# Altium schematic sheet Microcontroller.SchDoc
size A3; Revision: AA; SheetNumber: 3; SheetTotal: 3; PreparedBy: Furkan Çağatay Ekinci; ProjectDescription: Turkish Coffee Machine; ReleaseDate: 24.12.2023; changedDate: 28.12.2023
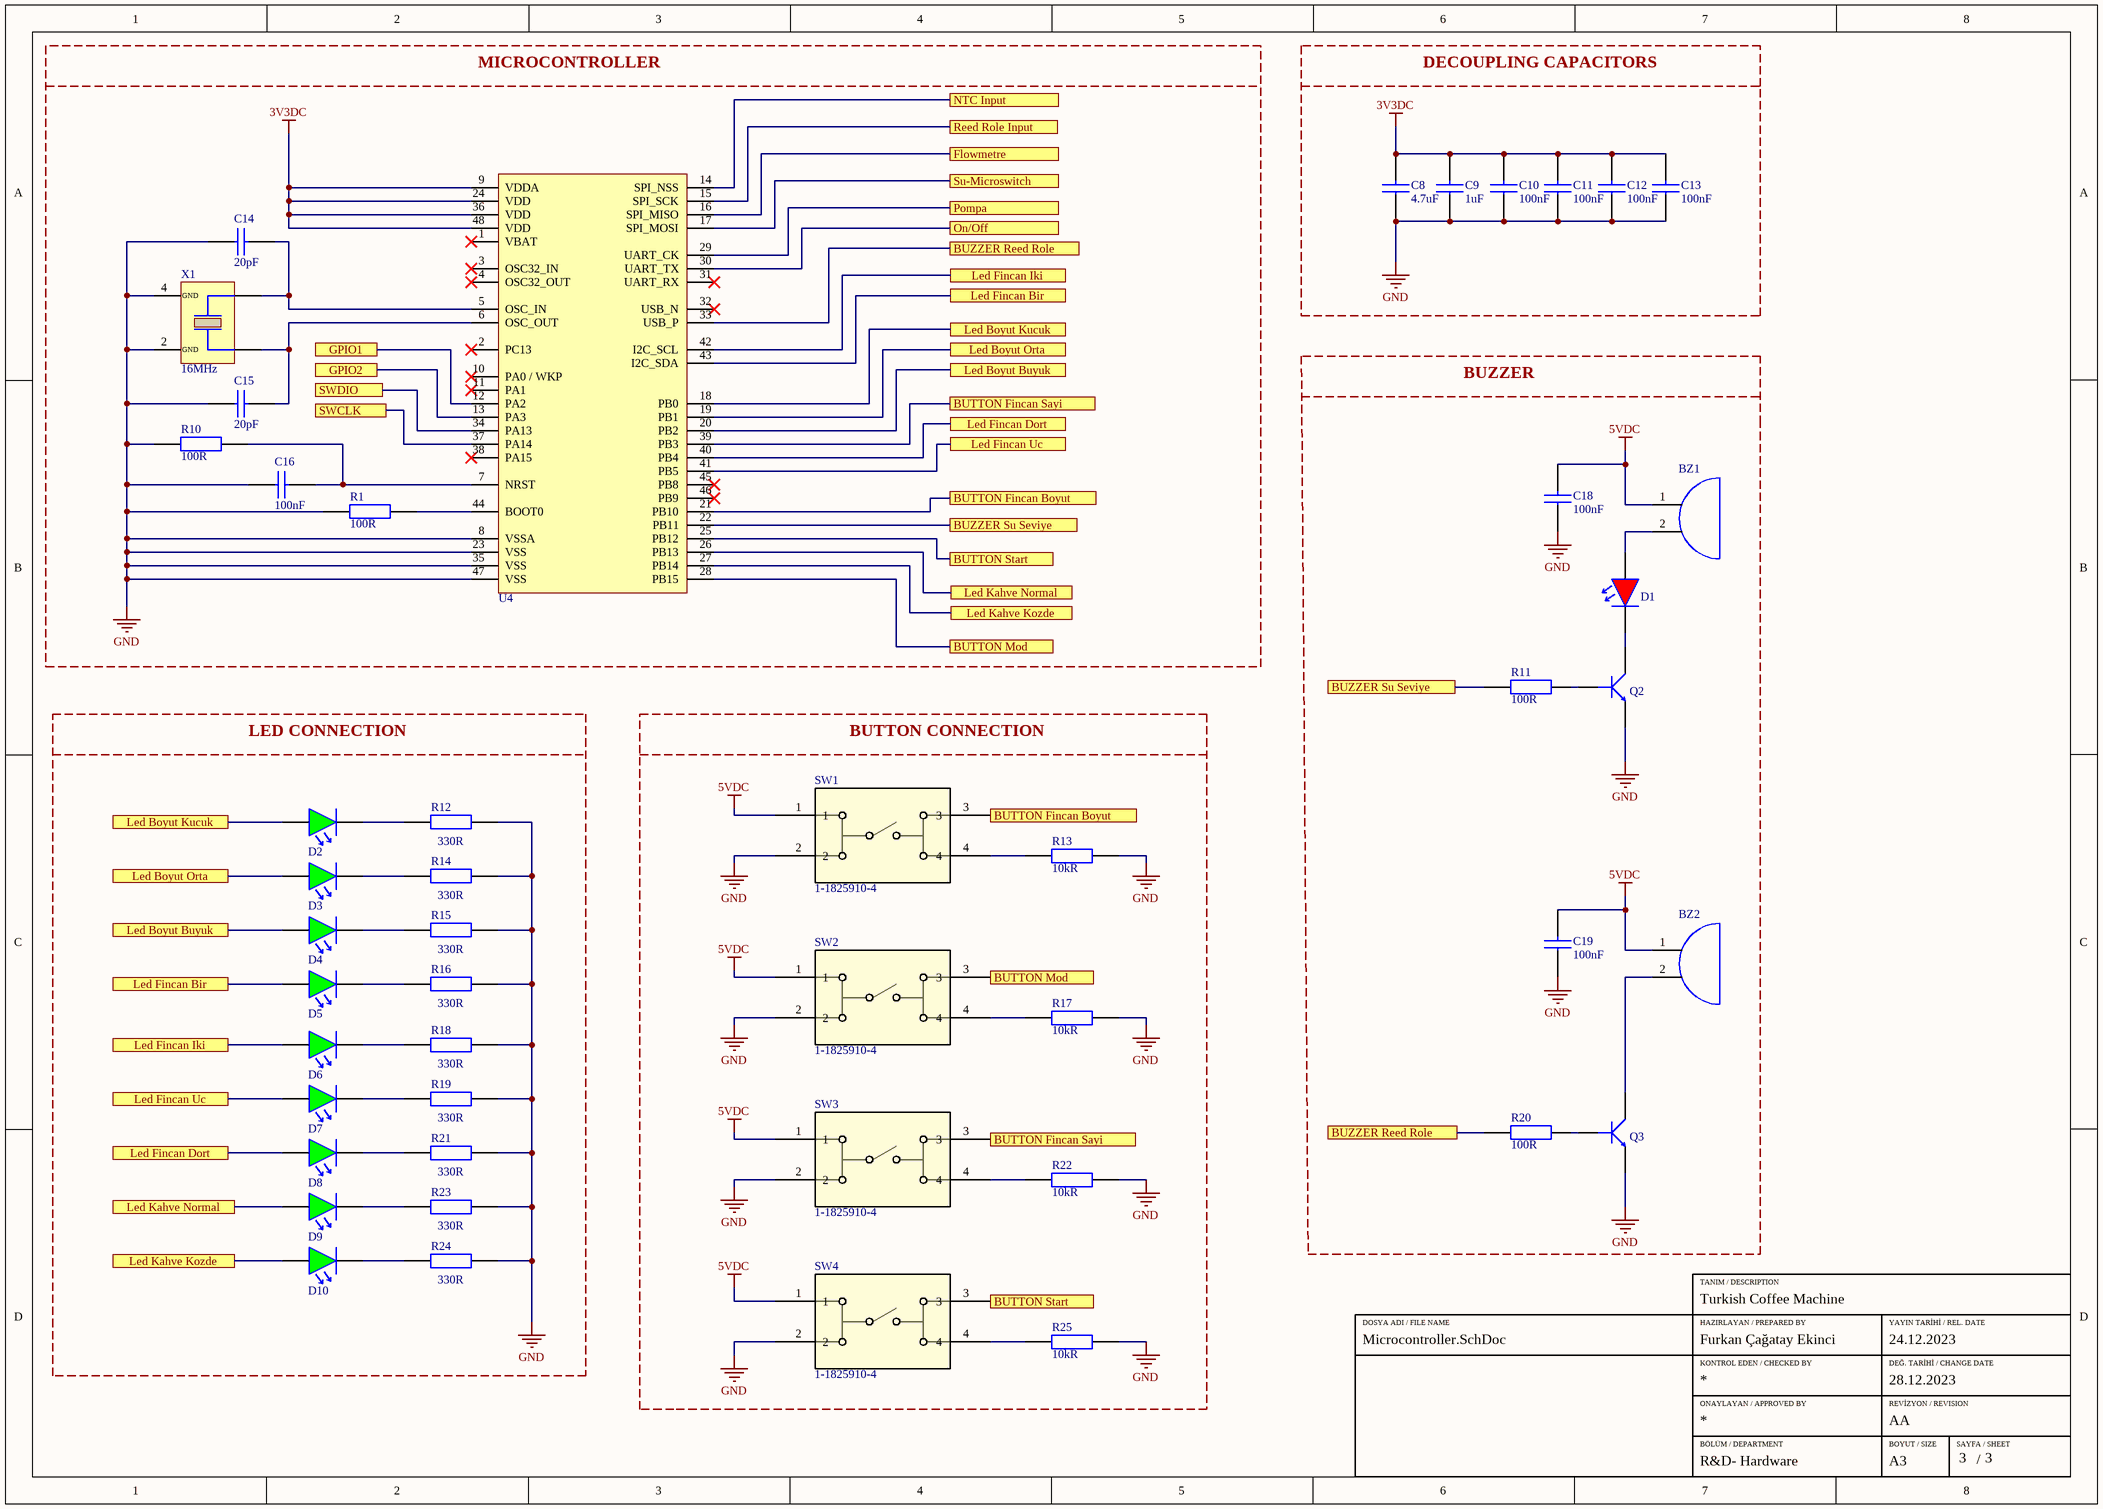
[diagram p0: Microcontroller.SchDoc]

## Parts
BZ1  CMI-9605IC-0580T  [CMI-9605IC]  (value not drawn)
BZ2  CMI-9605IC-0580T  [CMI-9605IC]  (value not drawn)
C8  Capacitance: 4.7uF  [CAP_0805]  (hidden comment: CL21A475KAQNNNE)
C9  Capacitance: 1uF  [CAP_0805]  (hidden comment: CL21B105KBFNNNE)
C10  Capacitance: 100nF  [CAP_0603]  (hidden comment: C0603C104K5RACTU)
C11  Capacitance: 100nF  [CAP_0603]  (hidden comment: C0603C104K5RACTU)
C12  Capacitance: 100nF  [CAP_0603]  (hidden comment: C0603C104K5RACTU)
C13  Capacitance: 100nF  [CAP_0603]  (hidden comment: C0603C104K5RACTU)
C14  Capacitance: 20pF  [CAP_0603]  (hidden comment: CL10C200JB8NNNC)
C15  Capacitance: 20pF  [CAP_0603]  (hidden comment: CL10C200JB8NNNC)
C16  Capacitance: 100nF  [CAP_0603]  (hidden comment: C0603C104K5RACTU)
C18  Capacitance: 100nF  [CAP_0603]  (hidden comment: C0603C104K5RACTU)
C19  Capacitance: 100nF  [CAP_0603]  (hidden comment: C0603C104K5RACTU)
D1  LH R974-LP-1  [LED_RED_0805]  (value not drawn)
D2  LTST-C171GKT  [LED_GREEN_0805]  (value not drawn)
D3  LTST-C171GKT  [LED_GREEN_0805]  (value not drawn)
D4  LTST-C171GKT  [LED_GREEN_0805]  (value not drawn)
D5  LTST-C171GKT  [LED_GREEN_0805]  (value not drawn)
D6  LTST-C171GKT  [LED_GREEN_0805]  (value not drawn)
D7  LTST-C171GKT  [LED_GREEN_0805]  (value not drawn)
D8  LTST-C171GKT  [LED_GREEN_0805]  (value not drawn)
D9  LTST-C171GKT  [LED_GREEN_0805]  (value not drawn)
D10  LTST-C171GKT  [LED_GREEN_0805]  (value not drawn)
Q2  MMBT3904-7-F  [SOT-23F]  (value not drawn)
Q3  MMBT3904-7-F  [SOT-23F]  (value not drawn)
R1  Resistance: 100R  [RES_0603]  (hidden comment: RC0603JR-07100RL)
R10  Resistance: 100R  [RES_0603]  (hidden comment: RC0603JR-07100RL)
R11  Resistance: 100R  [RES_0603]  (hidden comment: RC0603JR-07100RL)
R12  RC0603JR-07330RL  [RES_0603]  (value not drawn)
R13  Resistance: 10kR  [RES_0603]  (hidden comment: RC0603FR-0710KL)
R14  RC0603JR-07330RL  [RES_0603]  (value not drawn)
R15  RC0603JR-07330RL  [RES_0603]  (value not drawn)
R16  RC0603JR-07330RL  [RES_0603]  (value not drawn)
R17  Resistance: 10kR  [RES_0603]  (hidden comment: RC0603FR-0710KL)
R18  RC0603JR-07330RL  [RES_0603]  (value not drawn)
R19  RC0603JR-07330RL  [RES_0603]  (value not drawn)
R20  Resistance: 100R  [RES_0603]  (hidden comment: RC0603JR-07100RL)
R21  RC0603JR-07330RL  [RES_0603]  (value not drawn)
R22  Resistance: 10kR  [RES_0603]  (hidden comment: RC0603FR-0710KL)
R23  RC0603JR-07330RL  [RES_0603]  (value not drawn)
R24  RC0603JR-07330RL  [RES_0603]  (value not drawn)
R25  Resistance: 10kR  [RES_0603]  (hidden comment: RC0603FR-0710KL)
SW1  1-1825910-4  [SW4_1825910-D_TEC]
SW2  1-1825910-4  [SW4_1825910-D_TEC]
SW3  1-1825910-4  [SW4_1825910-D_TEC]
SW4  1-1825910-4  [SW4_1825910-D_TEC]
U4  STM32F103C6T6A  [LQFP-48]  (value not drawn)
X1  Frequency: 16MHz  [ECS]  (hidden comment: ECS-160-20-30B-TR)

## Blocks framed on the sheet
MICROCONTROLLER: C14-C16 R1 R10 U4 X1
DECOUPLING CAPACITORS: C8-C13
BUZZER: BZ1 BZ2 C18 C19 D1 Q2 Q3 R11 R20
LED CONNECTION: D2-D10 R12 R14-R16 R18 R19 R21 R23 R24
BUTTON CONNECTION: R13 R17 R22 R25 SW1-SW4

## Ports
BUTTON Fincan Boyut (see Microcontroller[4B]), BUTTON Fincan Boyut (see Microcontroller[4C]), BUTTON Fincan Sayi (see Microcontroller[4B]), BUTTON Fincan Sayi (see Microcontroller[4D]), BUTTON Mod (see Microcontroller[4B]), BUTTON Mod (see Microcontroller[4C]), BUTTON Start (see Microcontroller[4B]), BUTTON Start (see Microcontroller[4D]), BUZZER Reed Role (see Microcontroller[4A]), BUZZER Reed Role (see Microcontroller[6D]), BUZZER Su Seviye (see Microcontroller[4B]), BUZZER Su Seviye (see Microcontroller[6B]), Flowmetre (see Power Management[7C]), GPIO1 (see Power Management[7C]), GPIO2 (see Power Management[7C]), Led Boyut Buyuk (see Microcontroller[1C]), Led Boyut Buyuk (see Microcontroller[4A]), Led Boyut Kucuk (see Microcontroller[1C]), Led Boyut Kucuk (see Microcontroller[4A]), Led Boyut Orta (see Microcontroller[1C]), Led Boyut Orta (see Microcontroller[4A]), Led Fincan Bir (see Microcontroller[1C]), Led Fincan Bir (see Microcontroller[4A]), Led Fincan Dort (see Microcontroller[1D]), Led Fincan Dort (see Microcontroller[4B]), Led Fincan Iki (see Microcontroller[1C]), Led Fincan Iki (see Microcontroller[4A]), Led Fincan Uc (see Microcontroller[1C]), Led Fincan Uc (see Microcontroller[4B]), Led Kahve Kozde (see Microcontroller[1D]), Led Kahve Kozde (see Microcontroller[4B]), Led Kahve Normal (see Microcontroller[1D]), Led Kahve Normal (see Microcontroller[4B]), NTC Input (see Power Management[6C]), On/Off (see Power Management[5A]), Pompa (see Power Management[7C]), Reed Role Input (see Power Management[6C]), Su-Microswitch (see Power Management[7C]), SWCLK (see Power Management[5C]), SWDIO (see Power Management[5C])

## Nets
3V3DC: C8.2 C9.2 C10.2 C11.2 C12.2 C13.2 U4.9(VDDA) U4.24(VDD) U4.36(VDD) U4.48(VDD)
5VDC: BZ1.1 BZ2.1 C18.2 C19.2 SW1.1 SW2.1 SW3.1 SW4.1
GND: C8.1 C9.1 C10.1 C11.1 C12.1 C13.1 C14.1 C15.1 C16.1 C18.1 C19.1 Q2.2(E) Q3.2(E) R1.1 R10.1 R12.2 R13.2 R14.2 R15.2 R16.2 R17.2 R18.2 R19.2 R21.2 R22.2 R23.2 R24.2 R25.2 SW1.2 SW2.2 SW3.2 SW4.2 U4.8(VSSA) U4.23(VSS) U4.35(VSS) U4.47(VSS) X1.2(GND) X1.4(GND)
BUTTON Fincan Boyut: SW1.3 U4.21(PB10) ; port BUTTON Fincan Boyut
BUTTON Fincan Sayi: SW3.3 U4.39(PB3) ; port BUTTON Fincan Sayi
BUTTON Mod: SW2.3 U4.28(PB15) ; port BUTTON Mod
BUTTON Start: SW4.3 U4.25(PB12) ; port BUTTON Start
BUZZER Reed Role: R20.1 U4.33(USB_P) ; port BUZZER Reed Role
BUZZER Su Seviye: R11.1 U4.22(PB11) ; port BUZZER Su Seviye
Flowmetre: U4.16(SPI_MISO) ; port Flowmetre
GPIO1: U4.12(PA2) ; port GPIO1
GPIO2: U4.13(PA3) ; port GPIO2
Led Boyut Buyuk: D4.2 U4.20(PB2) ; port Led Boyut Buyuk
Led Boyut Kucuk: D2.2 U4.18(PB0) ; port Led Boyut Kucuk
Led Boyut Orta: D3.2 U4.19(PB1) ; port Led Boyut Orta
Led Fincan Bir: D5.2 U4.43(I2C_SDA) ; port Led Fincan Bir
Led Fincan Dort: D8.2 U4.40(PB4) ; port Led Fincan Dort
Led Fincan Iki: D6.2 U4.42(I2C_SCL) ; port Led Fincan Iki
Led Fincan Uc: D7.2 U4.41(PB5) ; port Led Fincan Uc
Led Kahve Kozde: D10.2 U4.27(PB14) ; port Led Kahve Kozde
Led Kahve Normal: D9.2 U4.26(PB13) ; port Led Kahve Normal
NTC Input: U4.14(SPI_NSS) ; port NTC Input
On/Off: U4.30(UART_TX) ; port On/Off
Pompa: U4.29(UART_CK) ; port Pompa
Reed Role Input: U4.15(SPI_SCK) ; port Reed Role Input
Su-Microswitch: U4.17(SPI_MOSI) ; port Su-Microswitch
SWCLK: U4.37(PA14) ; port SWCLK
SWDIO: U4.34(PA13) ; port SWDIO
NetBZ1_2: BZ1.2 D1.2
NetBZ2_2: BZ2.2 Q3.3(C)
NetC14_2: C14.2 U4.5(OSC_IN) X1.3
NetC15_2: C15.2 U4.6(OSC_OUT) X1.1
NetC16_2: C16.2 R10.2 U4.7(NRST)
NetD1_1: D1.1 Q2.3(C)
NetD2_1: D2.1 R12.1
NetD3_1: D3.1 R14.1
NetD4_1: D4.1 R15.1
NetD5_1: D5.1 R16.1
NetD6_1: D6.1 R18.1
NetD7_1: D7.1 R19.1
NetD8_1: D8.1 R21.1
NetD9_1: D9.1 R23.1
NetD10_1: D10.1 R24.1
NetQ2_1: Q2.1(B) R11.2
NetQ3_1: Q3.1(B) R20.2
NetR1_2: R1.2 U4.44(BOOT0)
NetR13_1: R13.1 SW1.4
NetR17_1: R17.1 SW2.4
NetR22_1: R22.1 SW3.4
NetR25_1: R25.1 SW4.4

Not connected (* = marked no-connect by the designer): U4 1(VBAT)* 2(PC13)* 3(OSC32_IN)* 4(OSC32_OUT)* 10(PA0_/_WKP)* 11(PA1)* 31(UART_RX)* 32(USB_N)* 38(PA15)* 45(PB8)* 46(PB9)*

## Notes on the sheet
- DOSYA ADI / FILE NAME
- HAZIRLAYAN / PREPARED BY
- TANIM / DESCRIPTION
- YAYIN TARİHİ / REL. DATE
- KONTROL EDEN / CHECKED BY
- DEĞ. TARİHİ / CHANGE DATE
- ONAYLAYAN / APPROVED BY
- BÖLÜM / DEPARTMENT
- BOYUT / SIZE
- REVİZYON / REVISION
- SAYFA / SHEET
- /
- R&D- Hardware
- A3

## Library data of the parts
BZ1 BZ2 = CMI-9605IC-0580T: Audio Buzzer Magnetic 3VDC 7VDC 30mA 5VDC 85dB 2600Hz to 2800Hz Through Hole Pin Box; Manufacturer: CUI Devices; Designed By: FCE; Supplier: Digi-Key; Supplier Part Number: 2223-CMI-9605IC-0580T-ND; Manufacturer Part Number: CMI-9605IC-0580T; RoHS: No; Category: Audio Products; Stock: 5921; Pricing: 1=1,22000, 10=1,01400, 25=0,93800, 50=0,88300, 100=0,82980, 250=0,76976, 500=0,71396, 1000=0,66741, 5000=0,65403 (USD)
C8 = CAP CER 4.7uF 0805: CAP CER 4.7uF %10 0805; Manufacturer: Samsung; Tolerance: 10%; Voltage Rating: 25V; Dielectric: X5R; Designed by: FCE; Supplier 1: Digi-Key; Manufacturer Part Number: CL21A475KAQNNNE; RoHS: Yes; Category: Ceramic Capacitors; Stock 1: 1477018; Pricing 1: 1=0,11000, 10=0,08100, 50=0,04580, 100=0,03800, 500=0,02664, 1000=0,02205 (USD); Mount: Surface Mount; Case/Package: 0805; Case Code (Metric): 2012; Case Code (Imperial): 0805; Min Operating Temperature: -55°C; Max Operating Temperature: 85°C; Package Quantity: 1; Packaging: Tape and Reel; Voltage Rating (DC): 25V; Series: CL; Construction: Flat; Length: 2mm; Width: 0.049inch; Height: 1.25mm; Thickness: 0.055inch; Depth: 1.25mm; Radiation Hardening: No; Lead Free: Lead Free; RoHS Compliant: Yes; ComponentLink1URL: https://datasheet.ciiva.com/25798/cl21a475kaqnnne-25798882.pdf?src-supplier=Digi-Key; ComponentLink1Description: https://datasheet.ciiva.com/25798/cl21a475kaqnnne-25798882.pdf?src-supplier=Digi-Key; Supplier Part Number 1: 1276-1244-1-ND
C9 = CAP CER 1uF 0805: CAP CER 1uF %10 0805; Manufacturer: Samsung; Designed by: FCE; Tolerance: 10%; Voltage Rating: 50V; Dielectric: X7R; Supplier 1: Digi-Key; Manufacturer Part Number: CL21B105KBFNNNE; RoHS: Yes; Category: Ceramic Capacitors; Stock 1: 958000; Pricing 1: 2000=0,02138, 4000=0,01956 (USD); Mount: Surface Mount; Case/Package: 0805; Case Code (Metric): 2012; Case Code (Imperial): 0805; Min Operating Temperature: -55°C; Max Operating Temperature: 125°C; Packaging: Tape and Reel; Package Quantity: 1; Voltage: 50V; Series: CL; Construction: Flat; Length: 2mm; Width: 0.049inch; Height: 1.25mm; Thickness: 0.053inch; Depth: 1.25mm; Radiation Hardening: No; RoHS Compliant: Yes; ComponentLink1URL: https://datasheet.ciiva.com/25800/cl21b105kbfnnne-25800291.pdf?src-supplier=Digi-Key; ComponentLink1Description: https://datasheet.ciiva.com/25800/cl21b105kbfnnne-25800291.pdf?src-supplier=Digi-Key; ComponentLink2URL: https://datasheet.ciiva.com/16449/cl21b105kbfnnne-16449003.pdf?src-supplier=Future+Electronics; ComponentLink2Description: https://datasheet.ciiva.com/16449/cl21b105kbfnnne-16449003.pdf?src-supplier=Future+Electronics; ComponentLink3URL: https://datasheet.ciiva.com/26838/getdatasheetpartid-354075-26838668.pdf?src-supplier=Verical; ComponentLink3Description: https://datasheet.ciiva.com/26838/getdatasheetpartid-354075-26838668.pdf?src-supplier=Verical; Supplier Part Number 1: 1276-1029-2-ND
C10-C13 C16 C18 C19 = CAP CER 100nF 0603: CAP CER 100nF %10 0603 SMD; Manufacturer: KEMET; Designed by: FCE; Dielectric Material: Ceramic; Voltage Rating (DC): 50V; Tolerance: 10%; Dielectric: X7R; Dissipation Factor: 2.5%; Supplier 1: Digi-Key; Manufacturer Part Number: C0603C104K5RACTU; RoHS: Yes; Category: Ceramic Capacitors; Stock 1: 1666186; Pricing 1: 1=0,12000, 10=0,08500, 50=0,04620, 100=0,03770, 500=0,02696, 1000=0,02118 (USD); Mount: Surface Mount; Case/Package: 0603; Number of Pins: 2; Case Code (Metric): 1608; Case Code (Imperial): 0603; Contact Plating: Tin,Matte; Min Operating Temperature: -55°C; Max Operating Temperature: 125°C; Packaging: Tape and Reel; Package Quantity: 1; Termination: SMD/SMT; Voltage: 50V; Voltage Rating: 50V; Series: SMD Comm X7R; Length: 0.063inch; Width: 0.031inch; Height: 0.8mm; Thickness: 0.034inch; Lead Pitch: 0.7mm; Depth: 0.8mm; Radiation Hardening: No; RoHS Compliant: Yes; REACH SVHC: No SVHC; ComponentLink1URL: https://datasheet.ciiva.com/7823/kem-c1002-x7r-smd-7823591.pdf?src-supplier=Element14; ComponentLink1Description: https://datasheet.ciiva.com/7823/kem-c1002-x7r-smd-7823591.pdf?src-supplier=Element14; ComponentLink2URL: https://datasheet.ciiva.com/14602/70095383-14602583.pdf?src-supplier=Allied+Electronics; ComponentLink2Description: https://datasheet.ciiva.com/14602/70095383-14602583.pdf?src-supplier=Allied+Electronics; ComponentLink3URL: https://datasheet.ciiva.com/5999/kem-c1002-x7r-smd-5999400.pdf?src-supplier=Farnell; ComponentLink3Description: https://datasheet.ciiva.com/5999/kem-c1002-x7r-smd-5999400.pdf?src-supplier=Farnell; ComponentLink4URL: https://datasheet.ciiva.com/7823/kem-c1002-x7r-smd-7823592.pdf?src-supplier=Element14; ComponentLink4Description: https://datasheet.ciiva.com/7823/kem-c1002-x7r-smd-7823592.pdf?src-supplier=Element14; ComponentLink5URL: https://datasheet.ciiva.com/28645/1851736-28645640.pdf?src-supplier=Element14; ComponentLink5Description: https://datasheet.ciiva.com/28645/1851736-28645640.pdf?src-supplier=Element14; ComponentLink6URL: https://datasheet.ciiva.com/14585/70095383-14585209.pdf?src-supplier=Allied+Electronics; ComponentLink6Description: https://datasheet.ciiva.com/14585/70095383-14585209.pdf?src-supplier=Allied+Electronics; Supplier Part Number 1: 399-5089-1-ND
C14 C15 = CAP CER 20pF 0603: CAP CER 20pF %5 0603 SMD; Manufacturer: Samsung; Tolerance: 5%; Dielectric: C0G; Voltage Rating: 50V; Temperature Coefficient: 300ppm/°C; Designed by: FCE; Supplier 1: Digi-Key; Manufacturer Part Number: CL10C200JB8NNNC; RoHS: Yes; Category: Ceramic Capacitors; Stock 1: 765558; Pricing 1: 1=0,10000, 10=0,04700, 50=0,02560, 100=0,02090, 500=0,01490, 1000=0,01171 (USD); Mount: Surface Mount; Case/Package: 0603; Case Code (Metric): 1608; Case Code (Imperial): 0603; Min Operating Temperature: -55°C; Max Operating Temperature: 125°C; Package Quantity: 1; Packaging: Tape and Reel; Voltage: 50V; Series: CL; Construction: Flat; Length: 1.6mm; Width: 0.031inch; Height: 0.8mm; Thickness: 0.035inch; Depth: 0.8mm; Radiation Hardening: No; RoHS Compliant: Yes; ComponentLink1URL: https://datasheet.ciiva.com/26877/getdatasheetpartid-640634-26877974.pdf?src-supplier=Verical; ComponentLink1Description: https://datasheet.ciiva.com/26877/getdatasheetpartid-640634-26877974.pdf?src-supplier=Verical; ComponentLink2URL: https://datasheet.ciiva.com/26310/mlcc-catalogdownload2013-eng-26310315.pdf?src-supplier=Distrelec; ComponentLink2Description: https://datasheet.ciiva.com/26310/mlcc-catalogdownload2013-eng-26310315.pdf?src-supplier=Distrelec; Supplier Part Number 1: 1276-1187-1-ND
D1 = LED RED 0805: LED Uni-Color Hyper Red 660nm 2-Pin Chip 0805(2012Metric) T/R; Manufacturer: Osram Opto; Lens Color: White; Forward Voltage: 1.8V; Lens Style: Diffused,Flat,Colorless; Luminous Intensity: 71mcd; Viewing Angle: 160°; Forward Current: 30mA; Dominant Wavelength: 645nm; Number of Elements: 1; Test Current: 20mA; Reverse Voltage: 5V; Lens Transparency: Diffused; Luminous Flux: 0.17lm; Lens Size: 1.25mm; Designed by: FCE; Supplier 1: Digi-Key; Manufacturer Part Number: LH R974-LP-1; RoHS: Yes; Category: LEDs; Stock 1: 35632; Pricing 1: 1=0,26000, 10=0,13900, 100=0,06480, 500=0,05978, 1000=0,04683, 2000=0,04584 (USD); Mount: Surface Mount; Case/Package: 0805; Number of Pins: 2; Color: Red; Case Code (Imperial): 0805; Case Code (Metric): 2012; Min Operating Temperature: -30°C; Max Operating Temperature: 85°C; Packaging: Tape and Reel; Illumination Color: Red; Package Quantity: 1; Series: CHipLED; Length: 2.1mm; Width: 1.25mm; Depth: 1.35mm; Radiation Hardening: No; RoHS Compliant: Yes; ComponentLink1URL: http://www.jameco.com/Jameco/Products/ProdDS/2085634.pdf?src-supplier=Jameco; ComponentLink1Description: http://www.jameco.com/Jameco/Products/ProdDS/2085634.pdf?src-supplier=Jameco; ComponentLink2URL: http://components.arrow.com/part/dataview/0323_01825492?src-supplier=Arrow+Europe; ComponentLink2Description: http://components.arrow.com/part/dataview/0323_01825492?src-supplier=Arrow+Europe; ComponentLink3URL: https://dammedia.osram.info/media/resource/hires/osram-dam-2493888/LH%20R974.pdf?src-supplier=Digi-Key; ComponentLink3Description: https://dammedia.osram.info/media/resource/hires/osram-dam-2493888/LH%20R974.pdf?src-supplier=Digi-Key; ComponentLink4URL: http://www.mouser.com/ds/2/311/LH%20R974%20-%20CHIPLED%200805-318659.pdf?src-supplier=Mouser; ComponentLink4Description: http://www.mouser.com/ds/2/311/LH%20R974%20-%20CHIPLED%200805-318659.pdf?src-supplier=Mouser; ComponentLink5URL: https://www.verical.com/server-webapp/html/getDatasheet?partID=258950&src-supplier=Verical; ComponentLink5Description: https://www.verical.com/server-webapp/html/getDatasheet?partID=258950&src-supplier=Verical; ComponentLink6URL: http://components.arrow.com/part/dataview/41971690S1077610N9133?src-supplier=Arrow+Electronics; ComponentLink6Description: http://components.arrow.com/part/dataview/41971690S1077610N9133?src-supplier=Arrow+Electronics; ComponentLink7URL: http://components.arrow.com/part/dataview/41971690S6190115N2128?src-supplier=Arrow+Electronics; ComponentLink7Description: http://components.arrow.com/part/dataview/41971690S6190115N2128?src-supplier=Arrow+Electronics; Supplier Part Number 1: 475-1415-1-ND
D2-D10 = LED GREEN 0805: Green 0805 130 º Min 5 mcd Typical 12 mcd Water Clear Lens SMT LED; Manufacturer: Vishay Lite-On; Designed by: FCE; Lens Color: Colorless; Viewing Angle: 130°; Lens Style: Diffused,Colorless,Rectangular,Clear; Luminous Intensity: 12mcd; Forward Current: 30mA; Forward Voltage: 2.1V; Power Rating: 100mW; Dominant Wavelength: 569nm; Test Current: 10mA; Number of Elements: 1; Wavelength: 585nm; Reverse Voltage: 5V; Supplier 1: Digi-Key; Manufacturer Part Number: LTST-C171GKT; RoHS: Yes; Category: LEDs; Stock 1: 159023; Pricing 1: 1=0,26000, 10=0,14100, 100=0,06560, 500=0,06060, 1000=0,04747 (USD); Mount: Surface Mount; Case/Package: 0805; Number of Pins: 2; Color: Green; Case Code (Metric): 2012; Case Code (Imperial): 0805; Min Operating Temperature: -55°C; Max Operating Temperature: 85°C; Package Quantity: 1; Packaging: Tape and Reel; Illumination Color: Green; Lens Transparency: Clear; Power Dissipation: 100mW; Number of LEDs: 1; Series: CHIPLED 0805; Length: 2mm; Width: 1.25mm; Height: 0.8mm; Depth: 1.25mm; Radiation Hardening: No; Lead Free: Lead Free; RoHS Compliant: Yes; ComponentLink1URL: https://datasheet.ciiva.com/2110/ltst-c171gkt-2110000.pdf?src-supplier=Digi-Key; ComponentLink1Description: https://datasheet.ciiva.com/2110/ltst-c171gkt-2110000.pdf?src-supplier=Digi-Key; ComponentLink2URL: https://datasheet.ciiva.com/11773/0900766b80dc0296-11773991.pdf?src-supplier=RSComponents; ComponentLink2Description: https://datasheet.ciiva.com/11773/0900766b80dc0296-11773991.pdf?src-supplier=RSComponents; ComponentLink3URL: https://datasheet.ciiva.com/12400/lite-on-ltst-c171gkt-190133-12400647.pdf?src-supplier=Mouser; ComponentLink3Description: https://datasheet.ciiva.com/12400/lite-on-ltst-c171gkt-190133-12400647.pdf?src-supplier=Mouser; ComponentLink4URL: https://datasheet.ciiva.com/2110/ltst-c171gkt-2110001.pdf?src-supplier=Digi-Key; ComponentLink4Description: https://datasheet.ciiva.com/2110/ltst-c171gkt-2110001.pdf?src-supplier=Digi-Key; ComponentLink5URL: https://datasheet.ciiva.com/2110/ltst-c171gkt-2110002.pdf?src-supplier=Digi-Key; ComponentLink5Description: https://datasheet.ciiva.com/2110/ltst-c171gkt-2110002.pdf?src-supplier=Digi-Key; ComponentLink6URL: https://datasheet.ciiva.com/16396/ltst-c171gkt-16396549.pdf?src-supplier=Future+Electronics; ComponentLink6Description: https://datasheet.ciiva.com/16396/ltst-c171gkt-16396549.pdf?src-supplier=Future+Electronics; Supplier Part Number 1: 160-1423-1-ND
Q2 Q3 = MMBT3904-7-F: Transistor General Purpose BJT NPN 40 Volt 0.2A Automotive 3-Pin SOT-23; Manufacturer: Diodes Zetex; Designed by: FCE; Max Power Dissipation: 300mW; Collector Emitter Voltage (VCEO): 40V; Max Collector Current: 200mA; Collector Base Voltage (VCBO): 60V; Frequency: 300MHz; hFE Min: 100; Number of Elements: 1; Emitter Base Voltage (VEBO): 6V; Collector Emitter Saturation Voltage: 300mV; Power Dissipation: 350mW; Element Configuration: Single; Supplier 1: Digi-Key; Manufacturer Part Number: MMBT3904-7-F; RoHS: Yes; Category: BJTs; Stock 1: 2393281; Pricing 1: 1=0,12000, 10=0,08600, 25=0,08280, 100=0,04660, 500=0,03664, 1000=0,02544 (USD); Mount: Surface Mount; Case/Package: SOT-23; Number of Pins: 3; Weight: 0.000282oz; Contact Plating: Tin,Matte; Min Operating Temperature: -55°C; Max Operating Temperature: 150°C; Polarity: NPN; Packaging: Tape and Reel; Package Quantity: 3000; Transition Frequency: 300MHz; Collector Emitter Breakdown Voltage: 40V; Max Breakdown Voltage: 40V; Continuous Collector Current: 200mA; Max Frequency: 300MHz; Gain Bandwidth Product: 300MHz; Series: -; Collector-emitter Voltage-Max: 300mV; Voltage Rating (DC): 40V; Length: 3.05mm; Width: 1.4mm; Height: 1mm; Radiation Hardening: No; REACH SVHC: No SVHC; Lead Free: Lead Free; RoHS Compliant: Yes; ComponentLink1URL: https://datasheet.ciiva.com/11201/ds30036-11201778.pdf?src-supplier=Avnet; ComponentLink1Description: https://datasheet.ciiva.com/11201/ds30036-11201778.pdf?src-supplier=Avnet; ComponentLink2URL: https://datasheet.ciiva.com/15138/getdatasheetpartid-53265-15138780.pdf?src-supplier=Verical; ComponentLink2Description: https://datasheet.ciiva.com/15138/getdatasheetpartid-53265-15138780.pdf?src-supplier=Verical; ComponentLink3URL: https://datasheet.ciiva.com/6361/ds30036-6361254.pdf?src-supplier=Digi-Key; ComponentLink3Description: https://datasheet.ciiva.com/6361/ds30036-6361254.pdf?src-supplier=Digi-Key; ComponentLink4URL: https://datasheet.ciiva.com/22711/1915516-22711750.pdf?src-supplier=Element14; ComponentLink4Description: https://datasheet.ciiva.com/22711/1915516-22711750.pdf?src-supplier=Element14; ComponentLink5URL: https://datasheet.ciiva.com/11198/ds30036-11198999.pdf?src-supplier=Avnet; ComponentLink5Description: https://datasheet.ciiva.com/11198/ds30036-11198999.pdf?src-supplier=Avnet; ComponentLink6URL: https://datasheet.ciiva.com/6361/ds30036-6361256.pdf?src-supplier=Digi-Key; ComponentLink6Description: https://datasheet.ciiva.com/6361/ds30036-6361256.pdf?src-supplier=Digi-Key; Supplier Part Number 1: MMBT3904-FDIDKR-ND
R1 R10 R11 R20 = RES 100 OHM 0603: RES 100 %5 OHM 0603 SMD; Manufacturer: Yageo; Designed by: FCE; Tolerance: 5%; Temperature Coefficient: 100ppm/°C; Voltage Rating (DC): 50V; Power Rating: 100mW; Supplier 1: Digi-Key; Manufacturer Part Number: RC0603JR-07100RL; RoHS: Yes; Category: Chip SMD Resistors; Stock 1: 4334796; Pricing 1: 1=0,10000, 10=0,01900, 100=0,00770, 1000=0,00344, 2500=0,00298 (USD); Case/Package: 0603; Number of Pins: 2; Contact Plating: Tin,Matte; Case Code (Imperial): 0603; Case Code (Metric): 1608; Size Code: 0603; Min Operating Temperature: -55°C; Max Operating Temperature: 155°C; Resistor Type: Thick Film; Packaging: Tape and Reel; Voltage Rating: 50V; Termination: SMD/SMT; Features: Moisture Resistant; Series: RC; Max Power Dissipation: 100mW; Number of Terminations: 2; Construction: Rectangular; Resistance Tolerance: 5%; Length: 1.6mm; Width: 0.8mm; Depth: 0.8mm; Radiation Hardening: No; REACH SVHC: Unknown; Lead Free: Lead Free; Military Standard: Not; RoHS Compliant: Yes; ComponentLink1URL: https://datasheet.ciiva.com/15189/getdatasheetpartid-325207-15189846.pdf?src-supplier=Verical; ComponentLink1Description: https://datasheet.ciiva.com/15189/getdatasheetpartid-325207-15189846.pdf?src-supplier=Verical; ComponentLink2URL: https://datasheet.ciiva.com/8883/pyu-rc0603-51-rohs-l-4-8883047.pdf?src-supplier=Avnet; ComponentLink2Description: https://datasheet.ciiva.com/8883/pyu-rc0603-51-rohs-l-4-8883047.pdf?src-supplier=Avnet; ComponentLink3URL: https://datasheet.ciiva.com/7746/443971-7746425.pdf?src-supplier=Element14; ComponentLink3Description: https://datasheet.ciiva.com/7746/443971-7746425.pdf?src-supplier=Element14; ComponentLink4URL: https://datasheet.ciiva.com/7746/443971-7746426.pdf?src-supplier=Element14; ComponentLink4Description: https://datasheet.ciiva.com/7746/443971-7746426.pdf?src-supplier=Element14; Supplier Part Number 1: 311-100GRCT-ND
R12 R14-R16 R18 R19 R21 R23 R24 = RES 330 OHM 0603: SMD Chip Resistor, 330 Ohm, ± 5%, 100 mW, 0603 [1608 Metric], Thick Film, General Purpose; Manufacturer: Yageo; Value: 330R; Power Rating: 100mW; Voltage Rating: 50V; Temperature Coefficient: 100ppm/°C; Designed By: FCE; Supplier: Digi-Key; Supplier Part Number: 311-330GRCT-ND; Manufacturer Part Number: RC0603JR-07330RL; RoHS: Yes; Category: Chip SMD Resistors; Stock: 3473788; Pricing: 1=0,10000, 10=0,01500, 50=0,00940, 100=0,00770, 500=0,00516, 1000=0,00441 (USD); Case/Package: 0603; Pins: 2; Case Code (Imperial): 0603; Case Code (Metric): 1608; Min Operating Temperature: -55°C; Max Operating Temperature: 155°C; Tolerance: 5%; Voltage Rating (DC): 50V; Resistor Type: Thick Film; Resistance Tolerance: 5%; Packaging: Tape and Reel; Package Quantity: 5000; Termination: SMD/SMT; Features: Moisture Resistant; Series: RC; Max Power Dissipation: 100mW; Number of Terminations: 2; Construction: Rectangular; Length: 1.6mm; Width: 0.8mm; Height: 0.45mm; Depth: 0.8mm; Reach SVHC Compliant: No; RoHS Compliant: Yes; Military Standard: Not; Lead Free: Lead Free; ComponentLink1URL: https://datasheet.ciiva.com/46395/443971-46395145.pdf?src-supplier=Element14; ComponentLink1Description: https://datasheet.ciiva.com/46395/443971-46395145.pdf?src-supplier=Element14; ComponentLink2URL: https://datasheet.ciiva.com/12558/rc0603-272842-12558685.pdf?src-supplier=Mouser; ComponentLink2Description: https://datasheet.ciiva.com/12558/rc0603-272842-12558685.pdf?src-supplier=Mouser; ComponentLink3URL: https://datasheet.ciiva.com/7746/1868787-7746487.pdf?src-supplier=Element14; ComponentLink3Description: https://datasheet.ciiva.com/7746/1868787-7746487.pdf?src-supplier=Element14; ComponentLink4URL: https://datasheet.ciiva.com/7746/443971-7746488.pdf?src-supplier=Element14; ComponentLink4Description: https://datasheet.ciiva.com/7746/443971-7746488.pdf?src-supplier=Element14; ComponentLink5URL: https://datasheet.ciiva.com/15189/getdatasheetpartid-342831-15189868.pdf?src-supplier=Verical; ComponentLink5Description: https://datasheet.ciiva.com/15189/getdatasheetpartid-342831-15189868.pdf?src-supplier=Verical
R13 R17 R22 R25 = RES 10K OHM 0603: RES 10K %1 OHM 0603 SMD; Manufacturer: Yageo; Designed by: FCE; Tolerance: 1%; Temperature Coefficient: 100ppm/°C; Voltage Rating (DC): 50V; Power Rating: 100mW; Voltage Rating: 75V; Supplier 1: Digi-Key; Manufacturer Part Number: RC0603FR-0710KL; RoHS: Yes; Category: Chip SMD Resistors; Stock 1: 24140601; Pricing 1: 1=0,10000, 10=0,02300, 100=0,00930, 1000=0,00417, 2500=0,00362 (USD); Case/Package: 0603; Number of Pins: 2; Case Code (Imperial): 0603; Case Code (Metric): 1608; Weight: 7.1E-05oz; Size Code: 0603; Min Operating Temperature: -55°C; Max Operating Temperature: 155°C; Resistor Type: Thick Film; Packaging: Tape and Reel; Termination: SMD/SMT; Features: Moisture Resistant; Series: RC; Max Power Dissipation: 100mW; Number of Terminations: 2; Resistance Tolerance: 1%; Construction: Rectangular; Length: 1.6mm; Width: 0.8mm; Height: 0.45mm; Depth: 0.8mm; Lead Pitch: 0.3mm; REACH SVHC: Unknown; Lead Free: Lead Free; Military Standard: Not; RoHS Compliant: Yes; ComponentLink1URL: https://datasheet.ciiva.com/7660/38590-7660789.pdf?src-supplier=Element14; ComponentLink1Description: https://datasheet.ciiva.com/7660/38590-7660789.pdf?src-supplier=Element14; ComponentLink2URL: https://datasheet.ciiva.com/15189/getdatasheetpartid-409289-15189591.pdf?src-supplier=Verical; ComponentLink2Description: https://datasheet.ciiva.com/15189/getdatasheetpartid-409289-15189591.pdf?src-supplier=Verical; ComponentLink3URL: https://datasheet.ciiva.com/46440/1868787-46440891.pdf?src-supplier=Element14; ComponentLink3Description: https://datasheet.ciiva.com/46440/1868787-46440891.pdf?src-supplier=Element14; ComponentLink4URL: https://datasheet.ciiva.com/7983/443971-7983596.pdf?src-supplier=Element14; ComponentLink4Description: https://datasheet.ciiva.com/7983/443971-7983596.pdf?src-supplier=Element14; ComponentLink5URL: https://datasheet.ciiva.com/7746/1738695-7746239.pdf?src-supplier=Element14; ComponentLink5Description: https://datasheet.ciiva.com/7746/1738695-7746239.pdf?src-supplier=Element14; ComponentLink6URL: https://datasheet.ciiva.com/22747/443971-22747519.pdf?src-supplier=Element14; ComponentLink6Description: https://datasheet.ciiva.com/22747/443971-22747519.pdf?src-supplier=Element14; Supplier Part Number 1: 311-10.0KHRCT-ND
SW1-SW4 = 1-1825910-4: Switch Tactile OFF (ON) SPST Round Button PC Pins 0.05A 24VDC 100000Cycle 1.56N Thru-Hole; Mfr_Name: TE Connectivity; Actuator Material: PBT,Polybutylene; Mechanical Life: 100000Cycles; Operating Force: 160gf; Illumination Type: Non-Illuminated; Switch Function: Off-Mom; Actuator Type: Standard; Switch Travel: 0.25mm; Designed By: FCE; Copyright: Copyright (C) 2023 Ultra Librarian. All rights reserved.; Manufacturer_Part_Number: 1-1825910-4; RefDes: RefDes; Type: DEV; Supplier: Digi-Key; Supplier Part Number: 450-1653-ND; Manufacturer: TE Connectivity; Manufacturer Part Number: 1-1825910-4; RoHS: Yes; Category: Pushbutton Switches; Stock: 33482; Pricing: 1=0,16000, 10=0,15100, 25=0,14280, 100=0,12990, 250=0,12208, 500=0,11170, 1000=0,09352, 2500=0,09092, 5000=0,08572 (USD); Mounting Technology: Through Hole; Min Operating Temperature: -35°C; Max Operating Temperature: 85°C; Packaging: Bulk; Termination: PC Pin; Throw Configuration: SPST; Series: FSMJ; RoHS Compliant: Yes; ComponentLink1URL: https://www.te.com/commerce/DocumentDelivery/DDEController?Action=srchrtrv&amp;DocNm=1825910&amp;DocType=Customer+Drawing&amp;DocLang=English&src-supplier=Digi-Key; ComponentLink1Description: https://www.te.com/commerce/DocumentDelivery/DDEController?Action=srchrtrv&amp;DocNm=1825910&amp;DocType=Customer+Drawing&amp;DocLang=English&src-supplier=Digi-Key; ComponentLink2URL: https://datasheet.octopart.com/FSM8JH-Tyco-Electronics-datasheet-13549077.pdf?src-supplier=Farnell; ComponentLink2Description: https://datasheet.octopart.com/FSM8JH-Tyco-Electronics-datasheet-13549077.pdf?src-supplier=Farnell; ComponentLink3URL: https://datasheet.octopart.com/1-1825910-4-TE-Connectivity-datasheet-33021037.pdf?src-supplier=Future+Electronics; ComponentLink3Description: https://datasheet.octopart.com/1-1825910-4-TE-Connectivity-datasheet-33021037.pdf?src-supplier=Future+Electronics; ComponentLink4URL: https://datasheet.octopart.com/FSM8JH-TE-Connectivity---Alcoswitch-datasheet-159572710.pdf?src-supplier=Jameco; ComponentLink4Description: https://datasheet.octopart.com/FSM8JH-TE-Connectivity---Alcoswitch-datasheet-159572710.pdf?src-supplier=Jameco; ComponentLink5URL: https://datasheet.octopart.com/FSM8JH-Alcoswitch-datasheet-44414615.pdf?src-supplier=Master+Electronics; ComponentLink5Description: https://datasheet.octopart.com/FSM8JH-Alcoswitch-datasheet-44414615.pdf?src-supplier=Master+Electronics; ComponentLink6URL: https://datasheet.octopart.com/1-1825910-4-TE-Connectivity-datasheet-140613482.pdf?src-supplier=TME; ComponentLink6Description: https://datasheet.octopart.com/1-1825910-4-TE-Connectivity-datasheet-140613482.pdf?src-supplier=TME; ComponentLink7URL: https://datasheet.octopart.com/FSM8JH-TE-Connectivity---Alcoswitch-datasheet-41181131.pdf?src-supplier=Electro+Sonic; ComponentLink7Description: https://datasheet.octopart.com/FSM8JH-TE-Connectivity---Alcoswitch-datasheet-41181131.pdf?src-supplier=Electro+Sonic
U4 = STM32F103C6T6A: MCU 32-bit STM32F ARM Cortex M3 RISC 32KB Flash 2.5V/3.3V 48-Pin LQFP Tray; Manufacturer: STMicroelectronics; Number of Timers/Counters: 3; Max Supply Voltage: 3.6V; Frequency: 72MHz; Interface: I2C,SPI,USART; RAM Size: 10KB; Max Power Dissipation: 363mW; Number of I/Os: 37; Min Supply Voltage: 2V; Oscillator Type: Internal; Data Bus Width: 32b; Watchdog Timer: Yes; Peripherals: POR,PWM,WDT,DMA,Temp Sensor,I2C; Number of ADC Channels: 10; Number of SPI Channels: 1; SleepMode: OK; Designed by: FCE; Supplier 1: Digi-Key; Manufacturer Part Number: STM32F103C6T6A; RoHS: Yes; Category: Microcontrollers; Stock 1: 30; Pricing 1: 1=5,07000, 10=4,55000, 25=4,30120, 80=3,72763, 250=3,53648, 500=3,18600 (USD); Case/Package: LQFP; Number of Pins: 48; Weight: 0.006409oz; Min Operating Temperature: -40°C; Max Operating Temperature: 85°C; Package Quantity: 1500; Packaging: Tray; Max Frequency: 72MHz; Number of Programmable I/O: 37; Memory Type: FLASH; Memory Size: 32KB; Core Architecture: ARM; Series: STM32F103C6; Number of I2C Channels: 1; Address Bus Width: 32b; Length: 7mm; Width: 7mm; Height: 1.4mm; Radiation Hardening: No; Lead Free: Lead Free; REACH SVHC: No SVHC; RoHS Compliant: Yes; ComponentLink1URL: https://datasheet.ciiva.com/15122/getdatasheetpartid-69879-15122075.pdf?src-supplier=Verical; ComponentLink1Description: https://datasheet.ciiva.com/15122/getdatasheetpartid-69879-15122075.pdf?src-supplier=Verical; ComponentLink2URL: https://datasheet.ciiva.com/14100/pustm-arm-microcont-stm32f103-en-14100507.pdf?src-supplier=Distrelec; ComponentLink2Description: https://datasheet.ciiva.com/14100/pustm-arm-microcont-stm32f103-en-14100507.pdf?src-supplier=Distrelec; Supplier 2: Avnet; Stock 2: 2360; Pricing 2: 250=1,99138, 260=1,95951, 510=1,91172, 1300=1,87986, 2500=1,84800, 13000=1,81613, 25000=1,78427 (USD); Supplier Part Number 1: 497-11515-ND; Supplier Part Number 2: STM32F103C6T6A
X1 = CRYSTAL 16MHz: CRYSTAL 16.0000MHZ 20PF SMD; Manufacturer: ECS International; Designed by: FCE; Frequency Tolerance: 30ppm; ESR (Equivalent Series Resistance): 50R; Frequency Stability: 50ppm; Supplier 1: Digi-Key; Manufacturer Part Number: ECS-160-20-30B-TR; RoHS: Yes; Category: Crystals; Stock 1: 15303; Pricing 1: 1=1,33000, 10=1,26800, 50=1,23900, 100=1,06200, 500=1,03250 (USD); Mount: Surface Mount; Case/Package: SMD/SMT; Min Operating Temperature: -20°C; Max Operating Temperature: 70°C; Package Quantity: 1; Load Capacitance: 20pF; Packaging: Tape and Reel; Tolerance: 50ppm; Termination: SMD/SMT; Series: ECX-53B; Length: 0.197inch; Width: 0.126inch; Height: 0.033inch; Lead Free: Lead Free; RoHS Compliant: Yes; ComponentLink1URL: https://datasheet.ciiva.com/853/ecx-53b-853408.pdf?src-supplier=Digi-Key; ComponentLink1Description: https://datasheet.ciiva.com/853/ecx-53b-853408.pdf?src-supplier=Digi-Key; ComponentLink2URL: https://datasheet.ciiva.com/853/ecx-53b-853406.pdf?src-supplier=Digi-Key; ComponentLink2Description: https://datasheet.ciiva.com/853/ecx-53b-853406.pdf?src-supplier=Digi-Key; ComponentLink3URL: https://datasheet.ciiva.com/853/ecx-53b-853407.pdf?src-supplier=Digi-Key; ComponentLink3Description: https://datasheet.ciiva.com/853/ecx-53b-853407.pdf?src-supplier=Digi-Key; Supplier Part Number 1: XC1120CT-ND